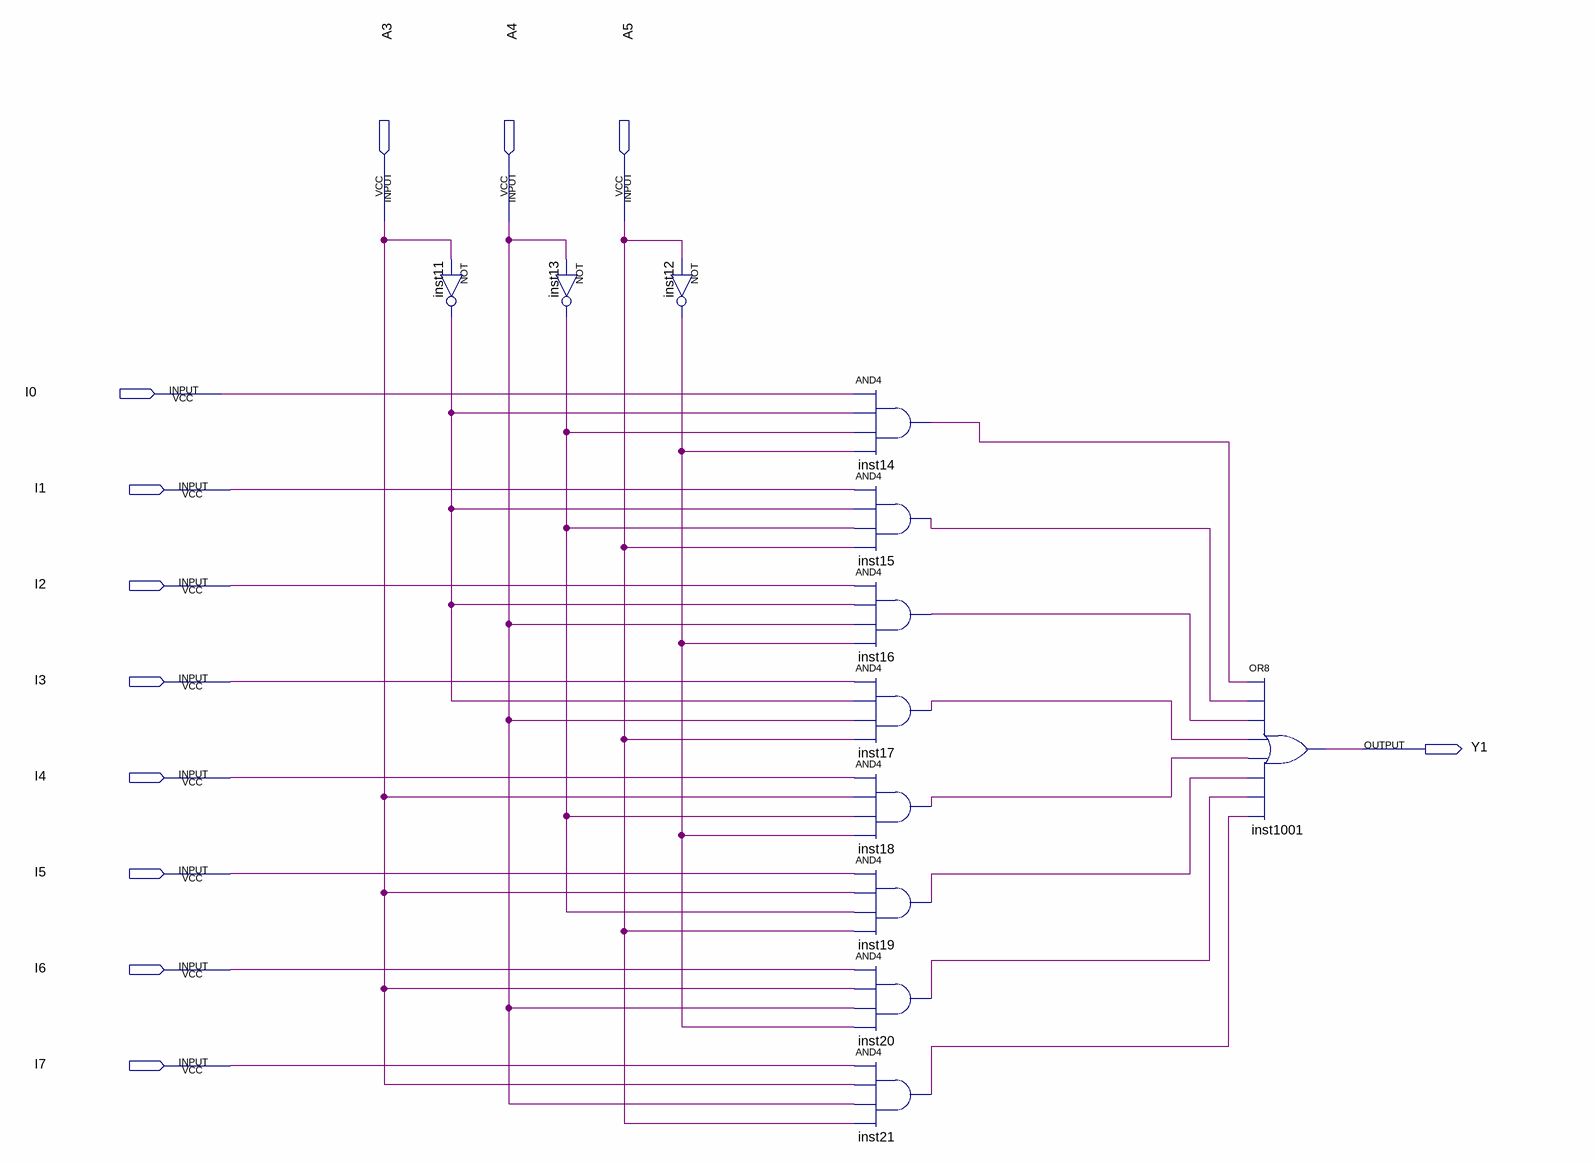
[diagram p0: schematic sheet]
// Quartus schematic MuxOchoAUno.bdf as structural Verilog: 12 symbols, 12 pins
module MuxOchoAUno (
  input  A3,
  input  A4,
  input  A5,
  input  I0,
  input  I1,
  input  I2,
  input  I3,
  input  I4,
  input  I5,
  input  I6,
  input  I7,
  output Y1
);

  wire inst11_out, inst12_out, inst13_out, inst14_out, inst15_out, inst16_out, inst17_out, inst18_out,
       inst19_out, inst20_out, inst21_out;

  not inst11 (inst11_out, A3);
  not inst13 (inst13_out, A4);
  not inst12 (inst12_out, A5);
  and inst14 (inst14_out, I0, inst11_out, inst13_out, inst12_out);
  and inst15 (inst15_out, I1, inst11_out, inst13_out, A5);
  and inst16 (inst16_out, I2, inst11_out, A4, inst12_out);
  and inst17 (inst17_out, I3, inst11_out, A4, A5);
  and inst18 (inst18_out, I4, A3, inst13_out, inst12_out);
  and inst19 (inst19_out, I5, A3, inst13_out, A5);
  and inst20 (inst20_out, I6, A3, A4, inst12_out);
  and inst21 (inst21_out, I7, A3, A4, A5);
  or inst1001 (Y1, inst14_out, inst15_out, inst16_out, inst17_out, inst18_out, inst19_out, inst20_out, inst21_out);
endmodule
